# EAGLE schematic hydrabot (EAGLE 9.6.2)
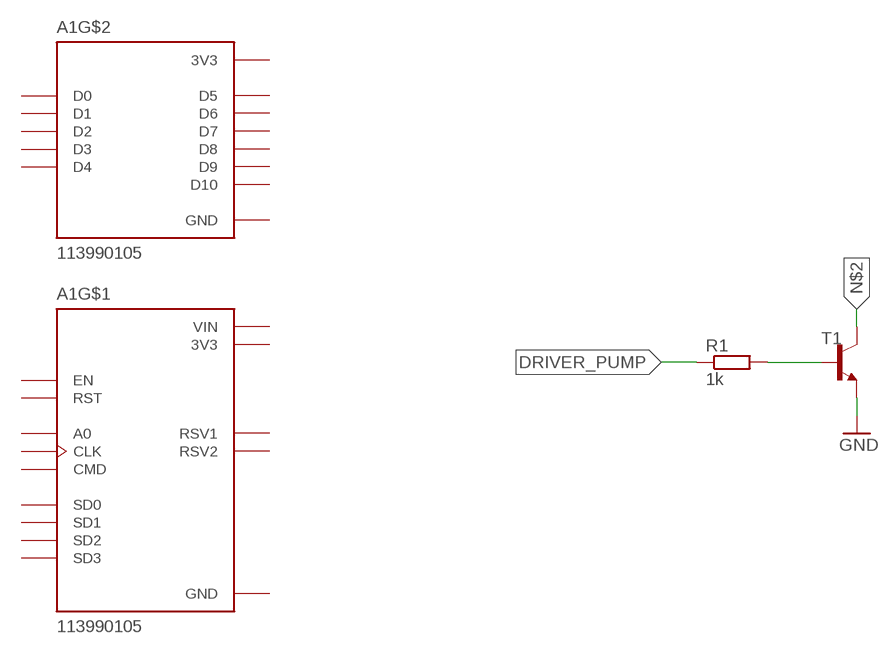
[diagram p0: schematic, sheet 1]

## Parts
A1  113990105  [SEEED_113990105]
R1  1k  R-EU_R0805  [R0805]
T1  -NPN-SOT223  [SOT223]

## Nets
DRIVER_PUMP: R1.1
GND: T1.3(E)
N$1: R1.2 T1.1(B)
N$2: T1.4(C)
Unconnected: A1.J1_1(A0) A1.J1_2(RSV1) A1.J1_3(RSV2) A1.J1_4(SD3) A1.J1_5(SD2) A1.J1_6(SD1) A1.J1_7(CMD) A1.J1_8(SD0) A1.J1_9(CLK) A1.J1_12(EN) A1.J1_13(RST) A1.J2_1(D0) A1.J2_2(D1) A1.J2_3(D2) A1.J2_4(D3) A1.J2_5(D4) A1.J2_8(D5) A1.J2_9(D6) A1.J2_10(D7) A1.J2_11(D8) A1.J2_12(D9) A1.J2_13(D10)

## Power pins joined to a net without a drawn wire
3V3: A1.J1_11(3V3) A1.J2_6(3V3) A1.J2_15(3V3)
GND: A1.J1_10(GND) A1.J1_14(GND) A1.J2_7(GND) A1.J2_14(GND)
VIN: A1.J1_15(VIN)

## Library data of the parts
A1 = 113990105:113990105: NodeMCU v2 - Lua based ESP8266 development kit; AVAILABILITY: Unavailable; DESCRIPTION: An open-source firmware and development kit that helps you to Prototype your IOT product within a few Lua script lines; MF: Seeed Technology; MP: NodeMCU v2; PACKAGE: None; PRICE: None
R1 = rcl:R-EU_: RESISTOR, European symbol; SPICEPREFIX: R
T1 = transistor-neu-to92:*-NPN-: NPN Transistror